# Altium schematic sheet SingleBoardControlRev1.SchDoc
size A
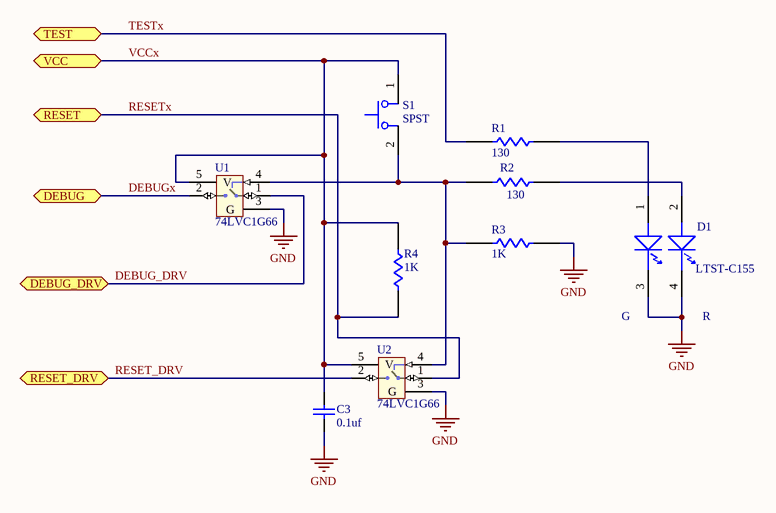
[diagram p0: SingleBoardControlRev1.SchDoc]

## Parts
C3  0.1uf  [0603_072205]
D1  LTST-C155  [LED 5mm x 2.5mm_061112]
R1  130  [0603_072205]
R2  130  [0603_072205]
R3  1K  [0603_072205]
R4  1K  [0603_072205]
S1  SPST  [SwitchDPDT_6_061412]
U1  74LVC1G66  [SOT25_030205]
U2  74LVC1G66  [SOT25_030205]

## Ports
DEBUG (bidir), DEBUG_DRV (bidir), RESET (bidir), RESET_DRV (bidir), TEST, VCC

## Nets
GND: C3.2 D1.3(K) D1.4(K) R3.2 U1.3(G) U2.3(G)
DEBUG_DRV: U1.1(INA) ; port DEBUG_DRV
DEBUGx: U1.2(OUTY) ; port DEBUG
RESET_DRV: U2.2(OUTY) ; port RESET_DRV
RESETx: R4.2 U2.1(INA) ; port RESET
TESTx: R1.2 ; port TEST
VCCx: C3.1 R4.1 S1.1 U1.5(V) U2.5(V) ; port VCC
NetD1_1: D1.1(G) R1.1
NetD1_2: D1.2(R) R2.1
NetR2_2: R2.2 R3.1 S1.2 U1.4(EN) U2.4(EN)

## Notes on the sheet
- (near D1) G
- (near D1) R

## Library data of the parts
C3 = Cap: Capacitor; PARTNO: C0603C104Z3VACTU; MAN: Kemet; VALUE: 0.1uf; DK: 399-1100-2-ND
D1 = LED_BI_2_1: PARTNO: LTST-C155GEKT; VALUE: LTST-C155; DK: 160-1172-2-ND
R1 R2 = RESISTOR: PARTNO: MCR03EZPFX1300; MAN: Rohm; VALUE: 130; DK: RHM130HTR-ND
R3 R4 = RESISTOR: PARTNO: MCR03EZPFX1001; MAN: Rohm; VALUE: 1K; DK: RHM1.00KHTR-ND
S1 = SWITCH PB: PARTNO: PVA2 EE H1; VALUE: SPST; DK: 401-1140-ND
U1 U2 = 7466_SINGLE: Single Solid State Switch; PARTNO: SN74LVC1G66DBVR; VALUE: 74LVC1G66; DK: 296-13253-1-ND